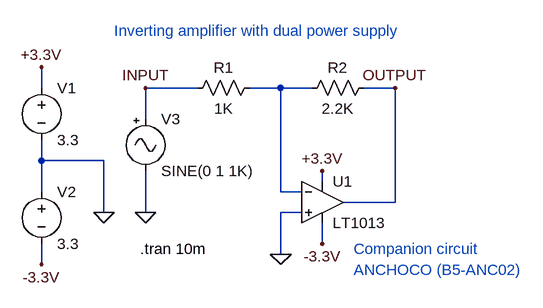
[diagram p0: schematic inverting_amp_dual_pow.asc]
inverting_amp_dual_pow.asc, the LTspice schematic file:
Version 4
SHEET 1 948 680
WIRE -432 48 -432 16
WIRE -192 48 -272 48
WIRE -64 48 -112 48
WIRE -16 48 -64 48
WIRE 112 48 64 48
WIRE -272 96 -272 48
WIRE -432 160 -432 128
WIRE -336 160 -432 160
WIRE 0 192 0 176
WIRE -432 208 -432 160
WIRE -64 208 -64 48
WIRE -32 208 -64 208
WIRE 112 224 112 48
WIRE 112 224 32 224
WIRE -336 240 -336 160
WIRE -272 240 -272 176
WIRE -32 240 -64 240
WIRE 0 288 0 256
WIRE -64 304 -64 240
WIRE -432 320 -432 288
FLAG -336 240 0
FLAG -432 16 +3.3V
FLAG -432 320 -3.3V
FLAG 0 176 +3.3V
FLAG 0 288 -3.3V
FLAG -272 240 0
FLAG -64 304 0
FLAG -272 48 INPUT
FLAG 112 48 OUTPUT
SYMBOL voltage -432 32 R0
WINDOW 123 0 0 Left 0
WINDOW 39 0 0 Left 0
SYMATTR InstName V1
SYMATTR Value 3.3
SYMBOL voltage -432 192 R0
WINDOW 123 0 0 Left 0
WINDOW 39 0 0 Left 0
SYMATTR InstName V2
SYMATTR Value 3.3
SYMBOL res -96 32 R90
WINDOW 0 0 56 VBottom 2
WINDOW 3 32 56 VTop 2
SYMATTR InstName R1
SYMATTR Value 1K
SYMBOL res 80 32 R90
WINDOW 0 0 56 VBottom 2
WINDOW 3 32 56 VTop 2
SYMATTR InstName R2
SYMATTR Value 2.2K
SYMBOL Misc\\signal -272 80 R0
WINDOW 123 0 0 Left 0
WINDOW 39 0 0 Left 0
SYMATTR InstName V3
SYMBOL Opamps\\LT1013 0 160 R0
SYMATTR InstName U1
TEXT -280 296 Left 2 !.tran 10m
TEXT -320 -40 Left 2 ;Inverting amplifier with dual power supply
TEXT 48 328 Left 2 ;ANCHOCO (B5-ANC02)
TEXT 48 296 Left 2 ;Companion circuit

The netlist it stands for:
* inverting_amp_dual_pow.asc
V1 +3.3V 0 3.3
V2 0 -3.3V 3.3
R1 N001 INPUT 1K
R2 OUTPUT N001 2.2K
V3 INPUT 0 SINE(0 1 1K)
XU1 0 N001 +3.3V -3.3V OUTPUT LT1013  ; pins In+ In- V+ V- OUT
.tran 10m
* Inverting amplifier with dual power supply
* ANCHOCO (B5-ANC02)
* Companion circuit
.lib LTC.lib
.backanno
.end